# EAGLE design adc-rtc-shield (EAGLE 6.4)
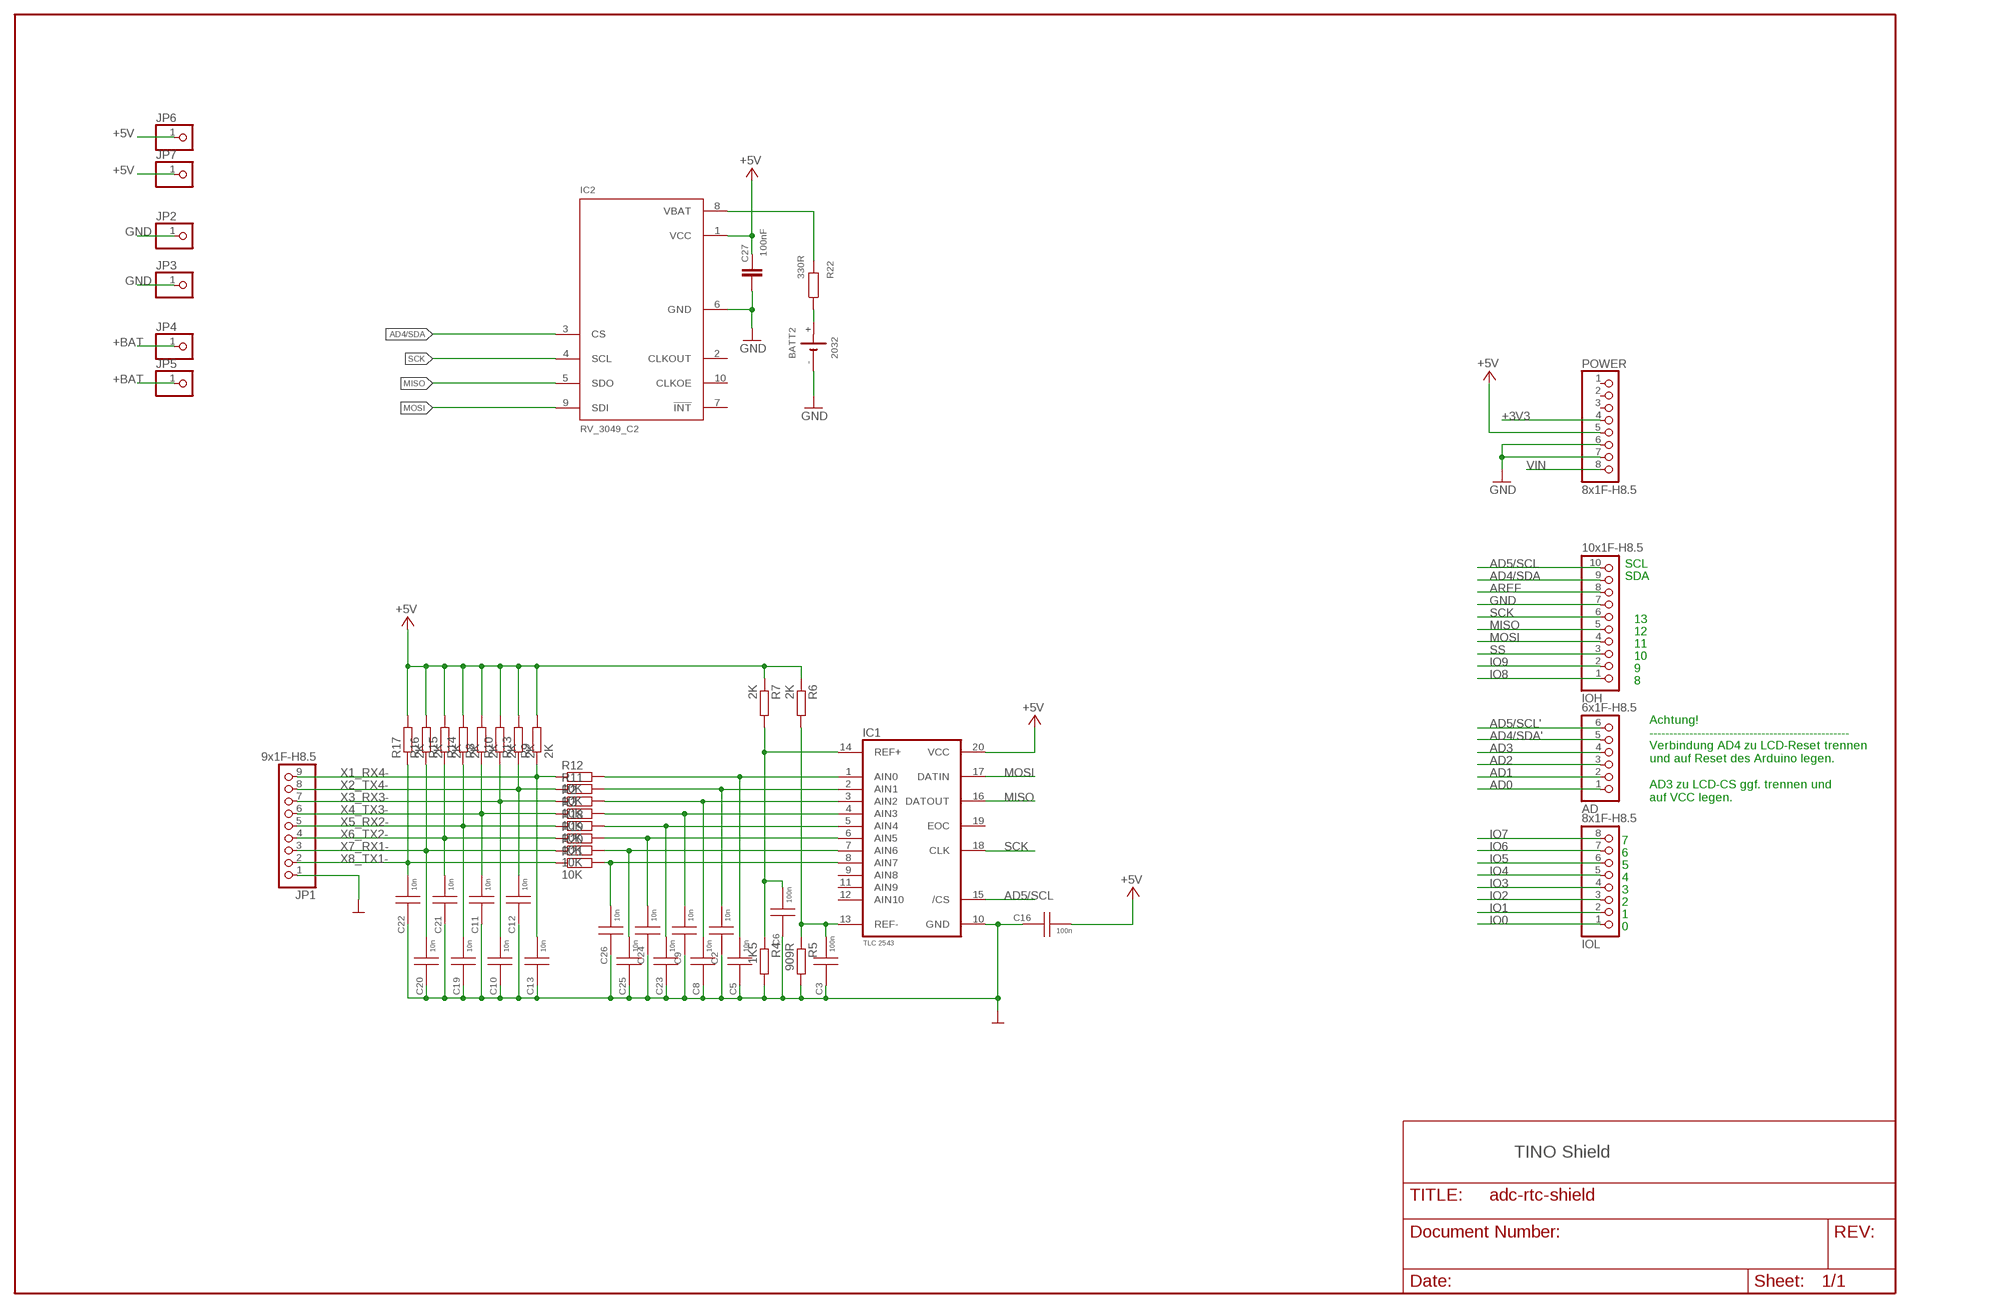
[diagram p0: schematic, sheet 1]

## Parts
AD  6x1F-H8.5  PINHD-1X6  [1X06]
BATT2  2032  CR2032_HOLDSMD  [2032_SMD]
C2  10n  C_KER  [0805-C]
C3  100n  C_KER  [0805-C]
C5  10n  C_KER  [0805-C]
C6  100n  C_KER  [0805-C]
C8  10n  C_KER  [0805-C]
C9  10n  C_KER  [0805-C]
C10  10n  C_KER  [0805-C]
C11  10n  C_KER  [0805-C]
C12  10n  C_KER  [0805-C]
C13  10n  C_KER  [0805-C]
C16  100n  C_KER  [0805-C]
C19  10n  C_KER  [0805-C]
C20  10n  C_KER  [0805-C]
C21  10n  C_KER  [0805-C]
C22  10n  C_KER  [0805-C]
C23  10n  C_KER  [0805-C]
C24  10n  C_KER  [0805-C]
C25  10n  C_KER  [0805-C]
C26  10n  C_KER  [0805-C]
C27  100nF  C-EUC0603  [C0603]
IC1  TLC2543  [DIL_20]
IC2  RV_3049_C2  [5X3.2_10]
IOH  10x1F-H8.5  PINHD-1X10_ARD  [1X10]
IOL  8x1F-H8.5  PINHD-1X8  [1X08]
JP1  9x1F-H8.5  PINHD-1X9/90  [1X09/90]
JP2  PINHD-1X1  [1X01]
JP3  PINHD-1X1  [1X01]
JP4  PINHD-1X1  [1X01]
JP5  PINHD-1X1  [1X01]
JP6  PINHD-1X1  [1X01]
JP7  PINHD-1X1  [1X01]
POWER  8x1F-H8.5  PINHD-1X8  [1X08]
R2  10K  R-EU_0207/12  [0207/12]
R3  10K  R-EU_0207/12  [0207/12]
R4  1K5  R-EU_0207/10  [0207/10]
R5  909R  R-EU_0207/10  [0207/10]
R6  2K  R-EU_0207/10  [0207/10]
R7  2K  R-EU_0207/12  [0207/12]
R8  2K  R-EU_0207/10  [0207/10]
R9  2K  R-EU_0207/10  [0207/10]
R10  2K  R-EU_0207/10  [0207/10]
R11  10K  R-EU_0207/12  [0207/12]
R12  10K  R-EU_0207/12  [0207/12]
R13  2K  R-EU_0207/10  [0207/10]
R14  2K  R-EU_0207/10  [0207/10]
R15  2K  R-EU_0207/10  [0207/10]
R16  2K  R-EU_0207/10  [0207/10]
R17  2K  R-EU_0207/10  [0207/10]
R18  10K  R-EU_0207/12  [0207/12]
R19  10K  R-EU_0207/12  [0207/12]
R20  10K  R-EU_0207/12  [0207/12]
R21  10K  R-EU_0207/12  [0207/12]
R22  330R  R-EU_0207/10  [0207/10]

## Nets
+3V3: POWER.4
+5V [usbvcc]: C16.2 C27.1 IC1.20(VCC) IC2.1(VCC) JP6.1 JP7.1 POWER.5 R6.1 R7.1 R8.2 R9.2 R10.2 R13.2 R14.2 R15.2 R16.2 R17.2
+BAT: BATT2.+ JP4.1 JP5.1 R22.1
AD0: AD.1
AD1: AD.2
AD2: AD.3
AD3: AD.4
AD4/SDA: IC2.3(CS) IOH.9
AD4/SDA': AD.5
AD5/SCL: IC1.15(/CS) IOH.10
AD5/SCL': AD.6
AREF [aref]: IOH.8
GND [gnd]: BATT2.- C2.1 C3.1 C5.1 C6.1 C8.1 C9.1 C10.1 C11.1 C12.1 C13.1 C16.1 C19.1 C20.1 C21.1 C22.1 C23.1 C24.1 C25.1 C26.1 C27.2 IC1.10(GND) IC2.6(GND) IOH.7 JP1.1 JP2.1 JP3.1 POWER.6 POWER.7 R4.2 R5.2
IO0: IOL.1
IO1: IOL.2
IO2: IOL.3
IO3: IOL.4
IO4: IOL.5
IO5: IOL.6
IO6: IOL.7
IO7: IOL.8
IO8: IOH.1
IO9: IOH.2
MISO: IC1.16(DATOUT) IC2.5(SDO) IOH.5
MOSI: IC1.17(DATIN) IC2.9(SDI) IOH.4
N$10: C3.2 IC1.13(REF-) R5.1 R6.2
N$11: C6.2 IC1.14(REF+) R4.1 R7.2
N$16: C2.2 IC1.2(AIN1) R11.2
N$17: C8.2 IC1.3(AIN2) R2.2
N$18: C9.2 IC1.4(AIN3) R3.2
N$19: C5.2 IC1.1(AIN0) R12.2
N$20: C23.2 IC1.5(AIN4) R18.2
N$21: C24.2 IC1.6(AIN5) R19.2
N$22: C25.2 IC1.7(AIN6) R20.2
N$23: C26.2 IC1.8(AIN7) R21.2
N$25: IC2.8(VBAT) R22.2
SCK: IC1.18(CLK) IC2.4(SCL) IOH.6
SS: IOH.3
VIN [power]: POWER.8
X1_RX4-: C13.2 JP1.9 R9.1 R12.1
X2_TX4-: C12.2 JP1.8 R11.1 R13.1
X3_RX3-: C10.2 JP1.7 R2.1 R10.1
X4_TX3-: C11.2 JP1.6 R3.1 R8.1
X5_RX2-: C19.2 JP1.5 R14.1 R18.1
X6_TX2-: C21.2 JP1.4 R15.1 R19.1
X7_RX1-: C20.2 JP1.3 R16.1 R20.1
X8_TX1-: C22.2 JP1.2 R17.1 R21.1
Unconnected: IC1.9(AIN8) IC1.11(AIN9) IC1.12(AIN10) IC1.19(EOC) IC2.2(CLKOUT) IC2.7(!INT) IC2.10(CLKOE) POWER.1 POWER.2 POWER.3

## Notes on the sheet
- SCL
- SDA
- 13
- 12
- 11
- 10
- 9
- 8
- Achtung!
  --------------------------------------------------
  Verbindung AD4 zu LCD-Reset trennen
  und auf Reset des Arduino legen.
  
  AD3 zu LCD-CS ggf. trennen und
  auf VCC legen.
- 7
- 6
- 5
- 4
- 3
- 2
- 1
- 0
- TINO Shield

## Library data of the parts
AD = SmartPrj:PINHD-1X6: PIN HEADER
BATT2 = El_Mech:CR2032_HOLD: Batteriehalter 2032; BESCHREIBUNG: Batteriehalter SMD; HERSTELLER: z.B. Würth; HERST_NR: z.B. 795 271 41; SIZE: 2032
C2 C3 C5 C6 C8-C13 C16 C19-C26 = Passiv:C_KER
C27 = rcl:C-EU: CAPACITOR, European symbol; BESCHREIBUNG: Keramik Vielschichtkondensator; HERSTELLER: Div.; TK: X7R; TOL: 20%; VOLT: 16V
IC1 = HL_IC1:TLC2543
IC2 = RTC_Quarz:RV_3049_C2: Real Time Clock Module with SPI-Bus; BESCHREIBUNG: Real Time Clock Module with SPI-Bus; HERSTELLER: Micro Crystal CH
IOH = SmartPrj:PINHD-1X10_ARD: PIN HEADER
IOL POWER = SmartPrj:PINHD-1X8: PIN HEADER
JP1 = pinhead:PINHD-1X9: PIN HEADER
JP2-JP7 = pinhead:PINHD-1X1: PIN HEADER
R2-R21 = resistor:R-EU_: RESISTOR, European symbol
R22 = rcl:R-EU_: RESISTOR, European symbol; TK: 100; TOL: 1%; VOLT: 50V

## Net classes
0 default: width 0.254 mm, clearance 0.254 mm
1 power: width 0.61 mm, drill 0.61 mm, clearance 0.254 mm
2 gnd: width 0.305 mm, drill 0.559 mm, clearance 0.254 mm
3 usbvcc: width 0.508 mm, drill 0.61 mm, clearance 0.254 mm
4 aref: width 0.406 mm, drill 0.61 mm, clearance 0.254 mm

## Board
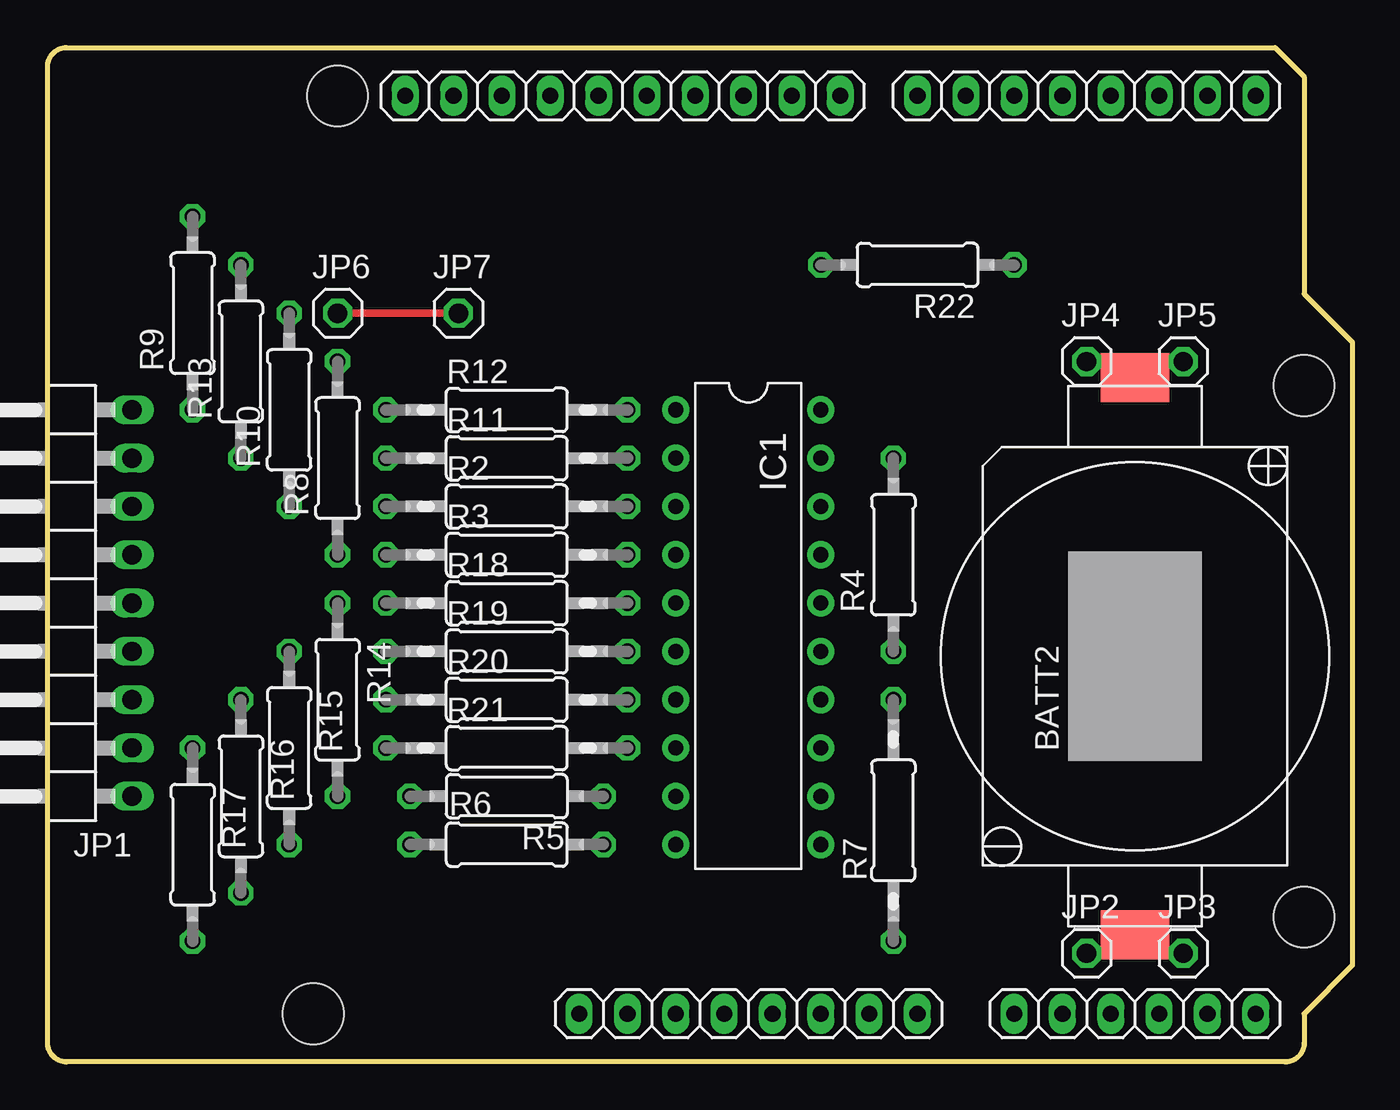
[diagram p1: board, top side]
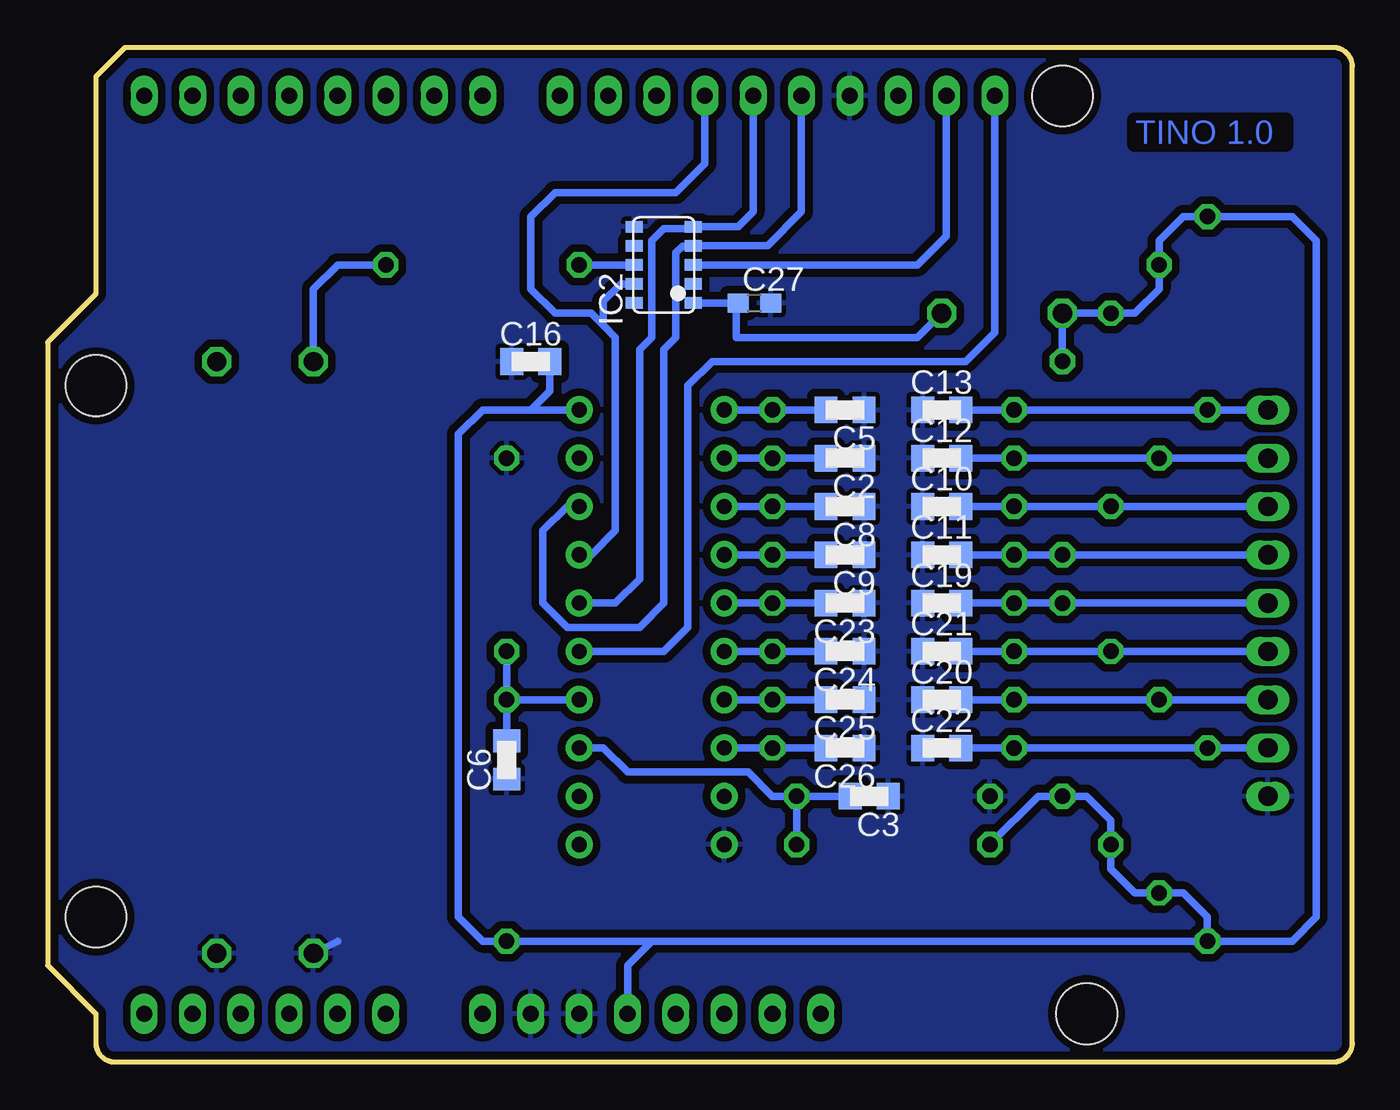
[diagram p2: board, bottom side, seen from below]

Size 68.58 x 53.34 mm. Coordinates in mm from the lower left corner, seen from the top.
Outline: 64.52,53.34 66.04,51.82 66.04,40.39 68.58,37.85 68.58,5.08 66.04,2.54 66.04,1 arc-90 65.04,0 1,0 arc-90 0,1 0,52.34 arc-90 1,53.34 64.52,53.34
Copper layers (1*16): Top 0.035mm / dielectric 1.5mm / Bottom 0.035mm
Design rules "Elecrow_2-layer_eagle_rule *": minimum track width 6mil, minimum drill 12mil, track to track 6mil, track to pad 6mil, pad to pad 6mil, via to via 6mil, smd to smd 0mil, copper to edge 10mil, drill to drill 10mil, minimum pad ring 10mil, minimum via ring 6mil, stop-mask expansion 2mil, vias tented up to drill 100mil, thermal gap 10mil
Holes 3.2 mm at 66.04,35.56 66.04,7.62 15.24,50.8 13.97,2.54

### Footprints (pad centres in the part's own frame; a part is rotated, then mirrored left to right if it is on the bottom)
1X06 = drill 0.85 pad 1.422 long: 1 -6.35,0; 2 -3.81,0; 3 -1.27,0; 4 1.27,0; 5 3.81,0; 6 6.35,0
2032_SMD = smd 3.6 x 2.6: + 0,-14.65; - 0,14.65
0805-C = smd 1.2 x 1.4: 1 -1,0; 2 1,0
C0603 = smd 1.1 x 1: 1 -0.85,0; 2 0.85,0
DIL_20 = drill 0.8 pad 1.422: 1 0,0; 2 2.54,0; 3 5.08,0; 4 7.62,0; 5 10.16,0; 6 12.7,0; 7 15.24,0; 8 17.78,0; 9 20.32,0; 10 22.86,0; 11 22.86,7.62; 12 20.32,7.62; 13 17.78,7.62; 14 15.24,7.62; 15 12.7,7.62; 16 10.16,7.62; 17 7.62,7.62; 18 5.08,7.62; 19 2.54,7.62; 20 0,7.62
5X3.2_10 = smd 0.6 x 0.9: 1 -2,-1.55; 2 -1,-1.55; 3 0,-1.55; 4 1,-1.55; 5 2,-1.55; 6 2,1.55; 7 1,1.55; 8 0,1.55; 9 -1,1.55; 10 -2,1.55
1X10@1 = drill 0.85 pad 1.422 long: 1 -11.43,0; 2 -8.89,0; 3 -6.35,0; 4 -3.81,0; 5 -1.27,0; 6 1.27,0; 7 3.81,0; 8 6.35,0; 9 8.89,0; 10 11.43,0
1X08 = drill 0.85 pad 1.422 long: 1 -8.89,0; 2 -6.35,0; 3 -3.81,0; 4 -1.27,0; 5 1.27,0; 6 3.81,0; 7 6.35,0; 8 8.89,0
1X09/90 = drill 1.016 long: 1 -10.16,-3.81; 2 -7.62,-3.81; 3 -5.08,-3.81; 4 -2.54,-3.81; 5 0,-3.81; 6 2.54,-3.81; 7 5.08,-3.81; 8 7.62,-3.81; 9 10.16,-3.81
1X01 = drill 1.016 octagon: 1 0,0
0207/12 = drill 0.813 octagon: 1 -6.35,0; 2 6.35,0
0207/10 = drill 0.813 octagon: 1 -5.08,0; 2 5.08,0

### Placement (x,y rotation side)
AD  57.15,2.54 0 top
BATT2  57.15,21.34 180 top
C2  26.67,31.75 180 bottom
C3  25.4,13.97 180 bottom
C5  26.67,34.29 180 bottom
C6  44.45,15.88 90 bottom
C8  26.67,29.21 180 bottom
C9  26.67,26.67 180 bottom
C10  21.59,29.21 0 bottom
C11  21.59,26.67 0 bottom
C12  21.59,31.75 0 bottom
C13  21.59,34.29 0 bottom
C16  43.18,36.83 0 bottom
C19  21.59,24.13 0 bottom
C20  21.59,19.05 0 bottom
C21  21.59,21.59 0 bottom
C22  21.59,16.51 0 bottom
C23  26.67,24.13 180 bottom
C24  26.67,21.59 180 bottom
C25  26.67,19.05 180 bottom
C26  26.67,16.51 180 bottom
C27  31.43,39.9 0 bottom
IC1  33.02,34.29 270 top
IC2  36.2,41.91 90 bottom
IOH  10x1F-H8.5  [1X10@1]  30.23,50.8 180 top
IOL  54.61,50.8 180 top
JP1  0.64,24.13 90 top
JP2  54.61,5.71 0 top
JP3  59.69,5.71 0 top
JP4  54.61,36.83 0 top
JP5  59.69,36.83 0 top
JP6  15.24,39.37 0 top
JP7  21.59,39.37 0 top
POWER  36.83,2.54 0 top
R2  24.13,29.21 0 top
R3  24.13,26.67 0 top
R4  44.45,26.67 90 top
R5  24.13,13.97 180 top
R6  24.13,11.43 0 top
R7  44.45,12.7 90 top
R8  15.24,31.75 90 top
R9  7.62,39.37 90 top
R10  12.7,34.29 90 top
R11  24.13,31.75 0 top
R12  24.13,34.29 0 top
R13  10.16,36.83 90 top
R14  15.24,19.05 270 top
R15  12.7,16.51 270 top
R16  10.16,13.97 270 top
R17  7.62,11.43 270 top
R18  24.13,24.13 0 top
R19  24.13,21.59 0 top
R20  24.13,19.05 0 top
R21  24.13,16.51 0 top
R22  45.72,41.91 180 top

### Tracks (layer width: path | path; a pad name or v marks a point on that pad's centre or on a via)
+5V
  Top 0.406: JP6.1 JP7.1
  Bottom 0.406: R17.2 36.83,6.35 | 36.83,6.35 R7.1 45.72,6.35 46.99,7.62 46.99,33.02 45.72,34.29 43.18,34.29 | C27.1 31.98,39.86 | R17.2 3.17,6.35 1.91,7.62 1.91,43.18 3.17,44.45 R9.2 8.89,44.45 10.16,43.18 R13.2 10.16,40.64 11.43,39.37 R10.2 JP6.1 R8.2 | C27.1 32.38,39.8 32.38,38.1 22.86,38.1 JP7.1 | IC2.1 C27.1 | IC1.20 43.18,34.29 | C16.2 42.18,35.29 43.18,34.29 | R17.2 7.62,7.62 8.89,8.89 R16.2 11.43,8.89 12.7,10.16 R15.2 12.7,12.7 13.97,13.97 R14.2 16.51,13.97 R6.1 | POWER.5 38.1,5.08 36.83,6.35
+BAT
  Top 0.406: JP4.1 56.31,36.83 BATT2.+ 57.58,35.99 58.42,36.83 JP5.1
  Bottom 0.406: R22.1 53.34,41.91 54.61,40.64 JP4.1
AD4/SDA
  Bottom 0.406: IC2.3 22.86,41.91 21.34,43.43 IOH.9
AD5/SCL
  Bottom 0.406: IOH.10 18.8,38.35 20.32,36.83 33.66,36.83 34.92,35.56 34.92,22.86 36.2,21.59 IC1.15
GND
  Top 0.406: JP2.1 56.81,6.35 BATT2.-
  Bottom 0.406: JP2.1 53.34,6.35
  pour Bottom (isolate 0.406, rank 2): 0.64,53.98 67.69,53.98 67.94,52.45 67.94,0.64 0.89,0.64 0.64,0.89
MISO
  Bottom 0.406: IC1.16 38.73,24.13 37.47,25.4 37.47,37.47 36.83,38.1 36.83,43.18 36.2,43.81 34.74,43.81 IC2.5 32.29,43.91 31.5,44.7 IOH.5
MOSI
  Bottom 0.406: IC2.9 38.47,40.91 39.37,40.01 39.37,38.73 | IC1.17 40.01,26.67 38.73,27.94 38.73,38.1 39.37,38.73 | IOH.4 34.04,47.24 35.56,45.72 41.91,45.72 43.18,44.45 43.18,40.64 41.91,39.37 40.01,39.37 39.37,38.73
N$10
  Bottom 0.406: R6.2 R5.1 | IC1.13 39.37,16.51 38.1,15.24 31.75,15.24 30.48,13.97 R5.1 | R5.1 C3.2
N$11
  Bottom 0.406: IC1.14 R7.2 | R7.2 R4.1 | R7.2 C6.2
N$16
  Bottom 0.406: IC1.2 R11.2 C2.2
N$17
  Bottom 0.406: IC1.3 R2.2 C8.2
N$18
  Bottom 0.406: IC1.4 R3.2 C9.2
N$19
  Bottom 0.406: IC1.1 R12.2 C5.2
N$20
  Bottom 0.406: IC1.5 R18.2 C23.2
N$21
  Bottom 0.406: IC1.6 R19.2 C24.2
N$22
  Bottom 0.406: IC1.7 R20.2 C25.2
N$23
  Bottom 0.406: IC1.8 R21.2 C26.2
N$25
  Bottom 0.406: IC2.8 R22.2
SCK
  Bottom 0.406: IC1.18 41.27,29.21 42.55,27.94 42.55,24.13 41.27,22.86 37.47,22.86 36.2,24.13 36.2,37.47 35.56,38.1 35.56,42.55 35.2,42.91 IC2.4 34.64,42.92 30.74,42.92 28.96,44.7 IOH.6
X1_RX4-
  Bottom 0.406: JP1.9 R9.1 R12.1 C13.2
X2_TX4-
  Bottom 0.406: JP1.8 R13.1 R11.1 C12.2
X3_RX3-
  Bottom 0.406: JP1.7 R10.1 R2.1 C10.2
X4_TX3-
  Bottom 0.406: JP1.6 R8.1 R3.1 C11.2
X5_RX2-
  Bottom 0.406: JP1.5 R14.1 R18.1 C19.2
X6_TX2-
  Bottom 0.406: JP1.4 R15.1 R19.1 C21.2
X7_RX1-
  Bottom 0.406: JP1.3 R16.1 R20.1 C20.2
X8_TX1-
  Bottom 0.406: JP1.2 R17.1 R21.1 C22.2

### Text on the board
Bottom: TINO 1.0
214bmp: D:/SmartProjects/Snc/a4_bn_logo2.bmp